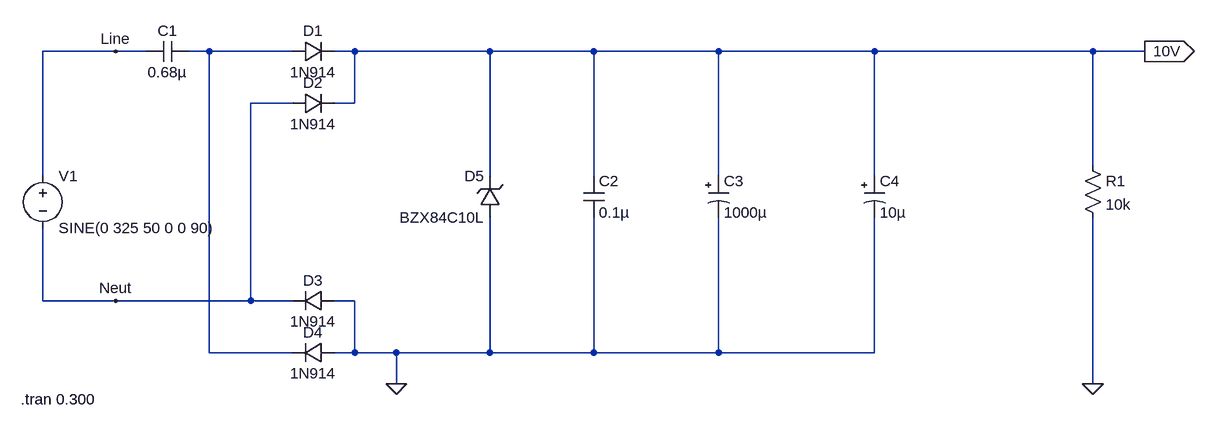
[diagram p0: schematic Alimentation.asc]
Alimentation.asc, the LTspice schematic file:
Version 4
SHEET 1 1656 680
WIRE -32 -16 -144 -16
WIRE 16 -16 -32 -16
WIRE 112 -16 80 -16
WIRE 240 -16 112 -16
WIRE 336 -16 304 -16
WIRE 544 -16 336 -16
WIRE 704 -16 544 -16
WIRE 896 -16 704 -16
WIRE 1136 -16 896 -16
WIRE 1472 -16 1136 -16
WIRE 1552 -16 1472 -16
WIRE 240 64 176 64
WIRE 336 64 336 -16
WIRE 336 64 304 64
WIRE 1472 160 1472 -16
WIRE -144 176 -144 -16
WIRE 544 176 544 -16
WIRE 704 176 704 -16
WIRE 896 176 896 -16
WIRE 1136 176 1136 -16
WIRE -144 368 -144 256
WIRE -32 368 -144 368
WIRE 176 368 176 64
WIRE 176 368 -32 368
WIRE 240 368 176 368
WIRE 336 368 304 368
WIRE 112 448 112 -16
WIRE 240 448 112 448
WIRE 336 448 336 368
WIRE 336 448 304 448
WIRE 400 448 336 448
WIRE 544 448 544 240
WIRE 544 448 400 448
WIRE 704 448 704 240
WIRE 704 448 544 448
WIRE 896 448 896 240
WIRE 896 448 704 448
WIRE 1136 448 1136 240
WIRE 1136 448 896 448
WIRE 400 496 400 448
WIRE 1472 496 1472 240
FLAG 400 496 0
FLAG 1552 -16 10V
IOPIN 1552 -16 Out
FLAG -32 368 Neut
FLAG -32 -16 Line
FLAG 1472 496 0
SYMBOL voltage -144 160 R0
WINDOW 123 0 0 Left 0
WINDOW 39 0 0 Left 0
SYMATTR InstName V1
SYMATTR Value SINE(0 325 50 0 0 90)
SYMBOL diode 240 0 R270
WINDOW 0 32 32 VTop 2
WINDOW 3 0 32 VBottom 2
SYMATTR InstName D1
SYMATTR Value 1N914
SYMBOL diode 240 80 R270
WINDOW 0 32 32 VTop 2
WINDOW 3 0 32 VBottom 2
SYMATTR InstName D2
SYMATTR Value 1N914
SYMBOL diode 304 352 R90
WINDOW 0 0 32 VBottom 2
WINDOW 3 32 32 VTop 2
SYMATTR InstName D3
SYMATTR Value 1N914
SYMBOL diode 304 432 R90
WINDOW 0 0 32 VBottom 2
WINDOW 3 32 32 VTop 2
SYMATTR InstName D4
SYMATTR Value 1N914
SYMBOL cap 80 -32 R90
WINDOW 0 0 32 VBottom 2
WINDOW 3 32 32 VTop 2
SYMATTR InstName C1
SYMATTR Value 0.68µ
SYMATTR SpiceLine V=200 Irms=4.42 Rser=0.0264301 Lser=0 mfg="KEMET" pn="C2220C684K2RAC" type="X7R"
SYMBOL zener 560 240 R180
WINDOW 0 24 64 Left 2
WINDOW 3 24 0 Left 2
SYMATTR InstName D5
SYMATTR Value BZX84C10L
SYMATTR Description Diode
SYMATTR Type diode
SYMBOL cap 688 176 R0
SYMATTR InstName C2
SYMATTR Value 0.1µ
SYMATTR SpiceLine V=500 Irms=867m Rser=0.0254657 Lser=0 mfg="KEMET" pn="C1812C104KCRAC" type="X7R"
SYMBOL polcap 880 176 R0
WINDOW 3 24 56 Left 2
SYMATTR InstName C3
SYMATTR Value 1000µ
SYMATTR Description Capacitor
SYMATTR Type cap
SYMATTR SpiceLine V=25 Irms=1.69 Rser=0.034 Lser=0 mfg="United Chemi-Con" pn="LXF25VB102M12X25LL" type="Al electrolytic"
SYMBOL polcap 1120 176 R0
WINDOW 3 24 56 Left 2
SYMATTR InstName C4
SYMATTR Value 10µ
SYMATTR Description Capacitor
SYMATTR Type cap
SYMATTR SpiceLine V=25 Irms=39m Rser=2.8 Lser=0 mfg="Nichicon" pn="UPR1E100MAH" type="Al electrolytic"
SYMBOL res 1456 144 R0
SYMATTR InstName R1
SYMATTR Value 10k
TEXT -178 520 Left 2 !.tran 0.300

The netlist it stands for:
* Alimentation.asc
V1 Line Neut SINE(0 325 50 0 0 90)
D1 N001 10V 1N914
D2 Neut 10V 1N914
D3 0 Neut 1N914
D4 0 N001 1N914
C1 N001 Line 0.68µ V=200 Irms=4.42 Rser=0.0264301 Lser=0 mfg="KEMET" pn="C2220C684K2RAC" type="X7R"
D5 0 10V BZX84C10L
C2 10V 0 0.1µ V=500 Irms=867m Rser=0.0254657 Lser=0 mfg="KEMET" pn="C1812C104KCRAC" type="X7R"
C3 10V 0 1000µ V=25 Irms=1.69 Rser=0.034 Lser=0 mfg="United Chemi-Con" pn="LXF25VB102M12X25LL" type="Al electrolytic"
C4 10V 0 10µ V=25 Irms=39m Rser=2.8 Lser=0 mfg="Nichicon" pn="UPR1E100MAH" type="Al electrolytic"
R1 10V 0 10k
.model D D
.lib standard.dio
.tran 0.300
.backanno
.end

* Results of the author's LTspice run, read from the files saved beside the schematic
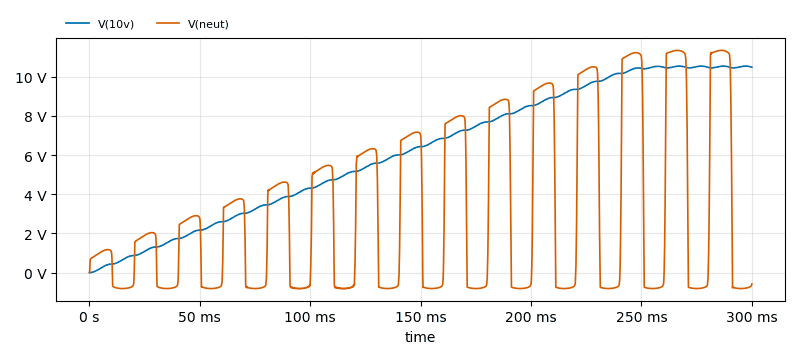
[diagram p1: Transient Analysis of Alimentation.asc, plotted from the saved traces]
* Transient Analysis, 1 run:
*   V(10v): min 0 V, max 10.54 V, average 6.203 V, rms 7.067 V, last 10.49 V
*   V(neut): min -828.2 mV, max 11.35 V, average 3.031 V, rms 5.334 V, last -580.6 mV